# Altium schematic sheet Biological Payload Data Consolidator.SchDoc
size A
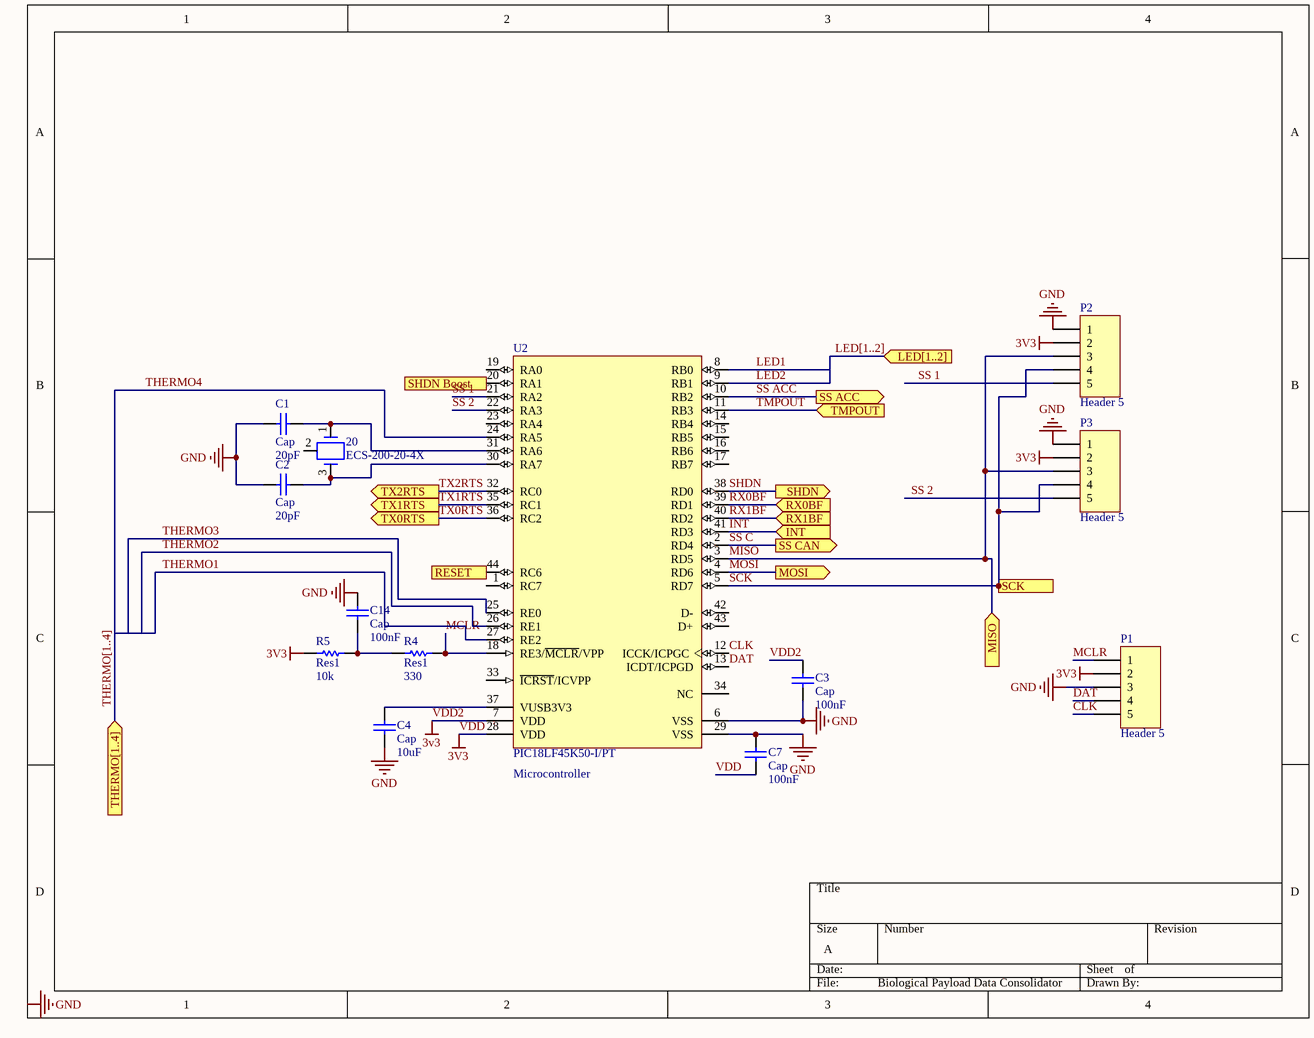
[diagram p0: Biological Payload Data Consolidator.SchDoc]

## Parts
20  ECS-200-20-4X  [ECS-4X-3IL]
C1  Cap  value 20pF  [0402-A]
C2  Cap  value 20pF  [0402-A]
C3  Cap  value 100nF  [1608[0603]]
C4  Cap  value 10uF  [6-0805_M]
C7  Cap  value 100nF  [1608[0603]]
C14  Cap  value 100nF  [1608[0603]]
P1  Header 5  [HDR1X5]
P2  Header 5  [CONN_B5B-XH-A (LF)(SN)_JST]
P3  Header 5  [CONN_B5B-XH-A (LF)(SN)_JST]
R4  Res1  value 330  [1608[0603]]
R5  Res1  value 10k  [0402-A]
U2  PIC18LF45K50-I/PT  [MCHP-TQFP-PT44_L]

## Ports
INT (in), LED[1..2] (in), MISO (in), MOSI (out), RESET (out), RX0BF (in), RX1BF (in), SCK (out), SHDN (out), SHDN Boost (out), SS ACC (out), SS CAN (out), THERMO[1..4] (in), TMPOUT (in), TX0RTS (out), TX1RTS (out), TX2RTS (out)

## Nets
GND: C1.2 C2.1 C3.1 C4.2 C7.1 C14.1 P1.3 P2.1 P3.1 U2.6(VSS) U2.29(VSS)
VDD: C3.2 C7.2 P1.2 P2.2 P3.2 R5.2 U2.7(VDD) U2.28(VDD)  [also labelled 3v3, VDD2]
CLK: P1.5 U2.12(ICCK/ICPGC)
DAT: P1.4 U2.13(ICDT/ICPGD)
INT: U2.41(RD3) ; port INT
LED1: U2.8(RB0)
LED2: U2.9(RB1)
MCLR: P1.1 R4.2 U2.18(RE3/~{MCLR}/VPP)
MISO: P2.3 P3.3 U2.3(RD5) ; port MISO
MOSI: U2.4(RD6) ; port MOSI
RESET: U2.44(RC6) ; port RESET
RX0BF: U2.39(RD1) ; port RX0BF
RX1BF: U2.40(RD2) ; port RX1BF
SCK: P2.4 P3.4 U2.5(RD7) ; port SCK
SHDN: U2.38(RD0) ; port SHDN
SHDN Boost: U2.20(RA1) ; port SHDN Boost
SS 1: P2.5 U2.21(RA2)
SS 2: P3.5 U2.22(RA3)
SS ACC: U2.10(RB2) ; port SS ACC
SS C: U2.2(RD4) ; port SS CAN
THERMO1: U2.27(RE2)
THERMO2: U2.26(RE1)
THERMO3: U2.25(RE0)
THERMO4: U2.24(RA5)
TMPOUT: U2.11(RB3) ; port TMPOUT
TX0RTS: U2.36(RC2) ; port TX0RTS
TX1RTS: U2.35(RC1) ; port TX1RTS
TX2RTS: U2.32(RC0) ; port TX2RTS
Net20_1: 20.1 C1.1 U2.31(RA6)
Net20_3: 20.3 C2.2 U2.30(RA7)
NetC4_1: C4.1 U2.37(VUSB3V3)
NetC14_2: C14.2 R4.1 R5.1

Not connected (* = marked no-connect by the designer): 20 2; U2 1(RC7) 14(RB4) 15(RB5) 16(RB6) 17(RB7) 19(RA0) 23(RA4) 33(~{ICRST}/ICVPP) 34(NC) 42(D-) 43(D+)

## Buses and harness runs
bus LED[1..2] = port LED[1..2]
bus THERMO[1..4] = port THERMO[1..4]

## Notes on the sheet
- (near U2) Microcontroller
- Labels drawn without touching a wire or pin: GND

## Library data of the parts
20 = CMP-1669-00001-2: CRYSTAL 20.000MHZ 20PF 49US; Manufacturer: ECS; ComponentLink1URL: http://www.ecsxtal.com/store/pdf/hc-49usx.pdf; PartNumber: ECS-200-20-4X; ComponentLink1Description: Datasheet; PackageReference: 4X-3IL
C1-C4 C7 C14 = Cap: Capacitor; Published: 8-Jun-2000; LatestRevisionDate: 17-Jul-2002; LatestRevisionNote: Re-released for DXP Platform.; PackageReference: RAD-0.3; Publisher: Altium Limited; PackageDescription: Radial Cap, Thru-Hole; 2 Leads; 0.3 in Pin Spacing
P1-P3 = Header 5: Header, 5-Pin; LatestRevisionDate: 17-Jul-2002; LatestRevisionNote: Re-released for DXP Platform.; Publisher: Altium Limited
R4 R5 = Res1: Resistor; Published: 8-Jun-2000; LatestRevisionDate: 17-Jul-2002; LatestRevisionNote: Re-released for DXP Platform.; PackageReference: AXIAL-0.3; Publisher: Altium Limited; PackageDescription: Axial Device, Thru-Hole; 2 Leads; 0.3 in Pin Spacing
U2 = CMP-0116-01766-1: Low-Power, High-Performance Microcontroller with XLP Technology, 48 MHz, 36 I/O, -40 to 85 degC, 44-pin TQFP (PT44), Tray; Manufacturer: Microchip; Timers: 2 - 8-bit, 2 - 16-bit, 0 - 32-bit; Operation Voltage Range: 1.8V - 3.6V; RAM: 2048; Max. CPU Speed MHz: 48; Memory Type: Flash; Program Memory KWords: 16; EEPROM Data Memory (bytes): 256; Internal Oscillator: 16 MHz, 31 kHz; I/O Pins: 36; Program Memory KBytes: 32; # of A/D Channels: 25; Digital Communication: 1 -A/E/USART, 1 -MSSP(SPI/I2C); ComponentLink3URL: Product URL:http://www.microchip.com/datasheet/PIC18F45K50; PackageReference: TQFP-PT44; Packing: TRAY; PartNumber: PIC18LF45K50-I/PT; Mounting Technology: Surface Mount; PackageVersion: C04-076B, 12/2012; PackageDescription: 44-Lead Plastic Thin Quad Flatpack, 10 x 10 mm Body, 0.8 mm Pitch; ComponentLink2URL: http://www.microchip.com/stellent/groups/techpub_sg/documents/packagingspec/en012702.pdf; ComponentLink3Description: URL Link1; ComponentLink2Description: Package Specification; DatasheetVersion: Rev. A; ComponentLink1URL: http://ww1.microchip.com/downloads/en/DeviceDoc/30684A.pdf; ComponentLink1Description: Datasheet